# Altium schematic sheet PWR_PAM2312_0V6_1A.SchDoc
size A3; SheetNumber: 19; SheetTotal: 22
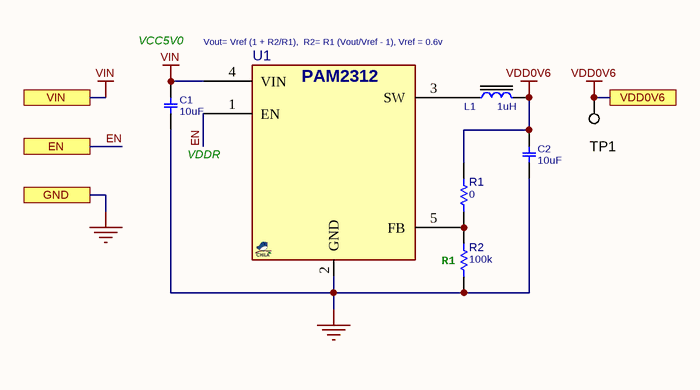
[diagram p0: PWR_PAM2312_0V6_1A.SchDoc]

## Parts
C1  10uF  [C0402]
C2  10uF  [C0402]
L1  1uH  [L0805]
R1  0  [R0402]
R2  100k  [R0402]
TP1  TESTPOINT_SMD  [TPSMD_S1]  (value not drawn)  (no BOM)
U1  PAM2312  [SOT23_5]  (value not drawn)

## Ports
EN, GND, VDD0V6, VIN

## Nets
GND: C1.1 C2.1 R2.2 U1.2(GND) ; port GND
VDD0V6: C2.2 L1.2 R1.1 TP1.1 ; port VDD0V6
VIN: C1.2 U1.4(VIN) ; port VIN
EN: U1.1(EN) ; port EN
NetL1_1: L1.1 U1.3(SW)
NetR1_2: R1.2 R2.1 U1.5(FB)

## Notes on the sheet
- (near C1) VCC5V0
- Vout= Vref (1 + R2/R1),  R2= R1 (Vout/Vref - 1), Vref = 0.6v
- VDDR
- (near R2) R1

## Library data of the parts
C1 C2 = CAP_SMD_MLCC: CAP, MLCC; PARAM: X5R, 20%; MANF_P#: CL05A106MP5NUNC; MANF: Samsung; PARAM2: 10v; PRICE: 10,000: $0.034; ASSEMBLY: ASSEMBLY; VALUE: 10uF
L1 = IND_SMD_2.2uH_4A: INDUCTOR; PARAM: 1.5A (Irms); DESC: INDUCTOR, 3.3uH, 8A (Irms), 10mOhm; PARAM2: 80mOhm; MANF_P#: LQM21PN1R0MGHL; PRICE: 1.3$; ASSEMBLY: ASSEMBLY; VALUE: 1uH
R1 R2 = RES_SMD: RESISTOR, SMD, 20K, 0402; PARAM: 0.063W; DIST#: MOUSER; PARAM2: 1%; MANF: -; ASSEMBLY: ASSEMBLY; PRICE: 100= 0.5$; DESC: RESISTOR, SMD, 20K, 0402; MANF_P#: -
  R1: VALUE: 0
  R2: VALUE: 100k
TP1 = TESTPOINT_SMD: TEST POINT; MANF: MANF; MANF_P#: MANF_P#; VALUE: VALUE
U1 = VREG_PAM2312_SOT23: REG, Switching, Buck, 1A, ADJ, 1.5MHz, 2.5~5.5VIN, SOT23-5; MANF: Diodes; PARAM: 1A, 1.5MHz, -40~85°C; PARAM2: 2.5~5.5VIN, ADJ; MANF_P#: PAM2312AABADJ; ASSEMBLY: ASSEMBLY; PRICE: 0.04$; DESC: -; VALUE: PAM2312